# Altium schematic sheet EEPROM.SchDoc
size A4; Date: 07.06.2021; Author: Mateusz Mróz; CompanyName: AGH; DocumentNumber: 4; SheetNumber: 4; SheetTotal: 6
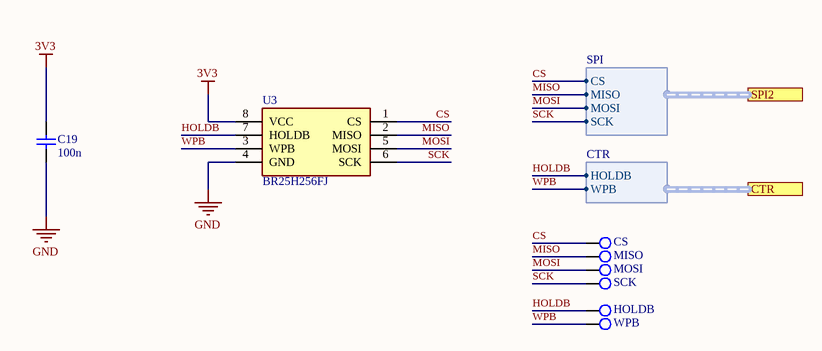
[diagram p0: EEPROM.SchDoc]

## Parts
C19  100n  [Cap_0603_MD_outline]
TP10  CS  [TP_SQ25x40]  (no BOM)
TP11  MISO  [TP_SQ25x40]  (no BOM)
TP12  MOSI  [TP_SQ25x40]  (no BOM)
TP13  SCK  [TP_SQ25x40]  (no BOM)
TP14  HOLDB  [TP_SQ25x40]  (no BOM)
TP15  WPB  [TP_SQ25x40]  (no BOM)
U3  BR25H256FJ  [SOIC127P600X165-8N]

## Ports
CTR (harness CTR), SPI2 (harness SPI)

## Harnesses
SPI: CS, MISO, MOSI, SCK
CTR: HOLDB, WPB

## Nets
3V3: C19.2 U3.8(VCC)
GND: C19.1 U3.4(GND)
CS: TP10.1 U3.1(CS) ; port SPI2.CS
HOLDB: TP14.1 U3.7(HOLDB) ; port CTR.HOLDB
MISO: TP11.1 U3.2(MISO) ; port SPI2.MISO
MOSI: TP12.1 U3.5(MOSI) ; port SPI2.MOSI
SCK: TP13.1 U3.6(SCK) ; port SPI2.SCK
WPB: TP15.1 U3.3(WPB) ; port CTR.WPB

## Notes on the sheet
- University name:
- Degree course:
- 3th year electronics
- Date:
- Author:
- Student Index:
- Course:
- Checked by:
- PUE
- dr hab. inż. Cezary Worek, prof. AGH
- 305093
- Project name:
- Document name:
- Variant name:
- Sheet/all:
- /
- Version number:

## Library data of the parts
C19 = Capacitor: MPN: GRM188R72A104KA35; Value: 100n; Package: 0603
TP10-TP15 = TestPoint: Test point; HelpURL: *; MPN: *
  TP10: Value: CS
  TP11: Value: MISO
  TP12: Value: MOSI
  TP13: Value: SCK
  TP14: Value: HOLDB
  TP15: Value: WPB
U3 = BR25H256FJ: EEPROM; Manufacturer_Name: ROHM Semiconductor; MPN: BR25H256FJ-2ACE2; Datasheet Link: https://ms.componentsearchengine.com/Datasheets/1/BR25H256FJ-2ACE2.pdf; Height: 1.65mm; Mouser Part Number: 755-BR25H256FJ-2ACE2; Mouser Price/Stock: https://www.mouser.co.uk/ProductDetail/ROHM-Semiconductor/BR25H256FJ-2ACE2?qs=zGux8KhMp6KpbA8DPfpjPg%3D%3D